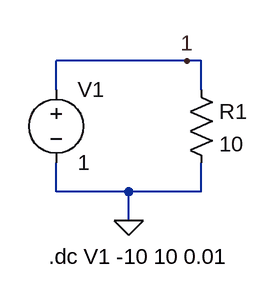
[diagram p0: schematic Fig_6-1_R_V-I.asc]
Fig_6-1_R_V-I.asc, the LTspice schematic file:
Version 4
SHEET 1 880 680
WIRE 240 112 96 112
WIRE 256 112 240 112
WIRE 96 144 96 112
WIRE 256 144 256 112
WIRE 96 256 96 224
WIRE 176 256 96 256
WIRE 256 256 256 224
WIRE 256 256 176 256
WIRE 176 288 176 256
FLAG 176 288 0
FLAG 240 112 1
SYMBOL res 240 128 R0
SYMATTR InstName R1
SYMATTR Value 10
SYMBOL voltage 96 128 R0
WINDOW 123 0 0 Left 2
WINDOW 39 0 0 Left 2
SYMATTR InstName V1
SYMATTR Value 1
TEXT 88 328 Left 2 !.dc V1 -10 10 0.01

The netlist it stands for:
* Fig_6-1_R_V-I.asc
R1 1 0 10
V1 1 0 1
.dc V1 -10 10 0.01
.backanno
.end